# EAGLE design comm (EAGLE 9.6.2)
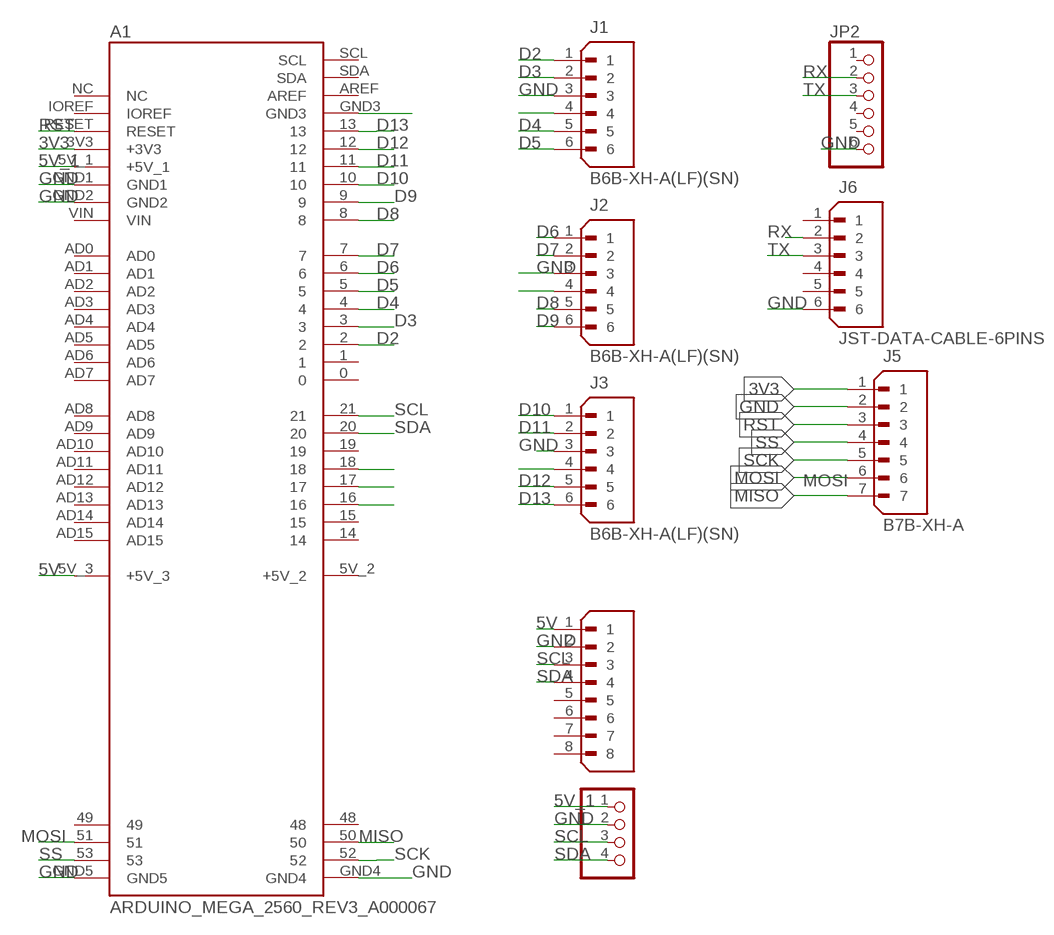
[diagram p0: schematic, sheet 1]

## Parts
A1  ARDUINO_MEGA_2560_REV3_A000067  [ARDUINO_ARDUINO_MEGA_2560_REV3_A000067]
J1  B6B-XH-A(LF)(SN)  [JST_B6B-XH-A(LF)(SN)]
J2  B6B-XH-A(LF)(SN)  [JST_B6B-XH-A(LF)(SN)]
J3  B6B-XH-A(LF)(SN)  [JST_B6B-XH-A(LF)(SN)]
J4  B8B-XH-A(LF)(SN)  [JST_B8B-XH-A(LF)(SN)]
J5  B7B-XH-A  [JST_B7B-XH-A]
J6  JST-DATA-CABLE-6PINS  [JST_B6B-XH-A(LF)(SN)]
JP1  PINHD-1X4  [1X04]
JP2  PINHD-1X6  [1X06]

## Nets
3V3: A1.3V3(+3V3) J5.1
5V: A1.5V_3(+5V_3) J4.1
5V_1: A1.5V_1(+5V_1) JP1.1
D2: A1.2 J1.1
D3: A1.3 J1.2
D4: A1.4 J1.5
D5: A1.5 J1.6
D6: A1.6 J2.1
D7: A1.7 J2.2
D8: A1.8 J2.5
D9: A1.9 J2.6
D10: A1.10 J3.1
D11: A1.11 J3.2
D12: A1.12 J3.4 J3.5
D13: A1.13 J3.6
GND: A1.GND1 A1.GND2 A1.GND4 A1.GND5 J1.3 J2.3 J3.3 J4.2 J5.2 J6.6 JP1.2 JP2.6
MISO: A1.50 J5.7
MOSI: A1.51 J5.6
N$2: A1.18
N$3: A1.17
N$4: J1.4
N$5: J2.4
N$6: A1.16
N$7: A1.GND3
RST: A1.RESET J5.3
RX: J6.2 JP2.2
SCK: A1.52 J5.5
SCL: A1.21 J4.3 JP1.3
SDA: A1.20 J4.4 JP1.4
SS: A1.53 J5.4
TX: J6.3 JP2.3
Unconnected: A1.0 A1.1 A1.5V_2(+5V_2) A1.14 A1.15 A1.19 A1.48 A1.49 A1.AD0 A1.AD1 A1.AD2 A1.AD3 A1.AD4 A1.AD5 A1.AD6 A1.AD7 A1.AD8 A1.AD9 A1.AD10 A1.AD11 A1.AD12 A1.AD13 A1.AD14 A1.AD15 A1.AREF A1.IOREF A1.NC A1.SCL A1.SDA A1.VIN J4.5 J4.6 J4.7 J4.8 J6.1 J6.4 J6.5 JP2.1 JP2.4 JP2.5

## Library data of the parts
A1 = Arduino mega for ROV:ARDUINO_MEGA_2560_REV3_A000067: Check availability <https://pricing.snapeda.com/parts/ARDUINO%20MEGA%202560%20REV3%20%7C%20A000067/Arduino/view-part?ref=eda>; AVAILABILITY: Not in stock; CHECK_PRICES: https://www.snapeda.com/parts/ARDUINO%20MEGA%202560%20REV3%20%7C%20A000067/Arduino/view-part/?ref=eda; DESCRIPTION: ATmega2560 Arduino Mega2560 AVR® ATmega AVR MCU 8-Bit Embedded Evaluation Board; MF: Arduino; MP: ARDUINO MEGA 2560 REV3 | A000067; PACKAGE: Non-Standard Arduino; PRICE: None; PURCHASE-URL: https://www.snapeda.com/api/url_track_click_mouser/?unipart_id=7072122&manufacturer=Arduino&part_name=ARDUINO MEGA 2560 REV3 | A000067&search_term=None; SNAPEDA_LINK: https://www.snapeda.com/parts/ARDUINO%20MEGA%202560%20REV3%20%7C%20A000067/Arduino/view-part/?ref=snap
J1-J3 = data-cable(6-pin):B6B-XH-A(LF)(SN): Check availability <https://pricing.snapeda.com/parts/B6B-XH-A%20%28LF%29%28SN%29/JST%20Sales/view-part?ref=eda>; AVAILABILITY: In Stock; CHECK_PRICES: https://www.snapeda.com/parts/B6B-XH-A%20(LF)(SN)/JST/view-part/?ref=eda; DESCRIPTION: Connector Header Through Hole 6 position 0.098 (2.50mm); MF: JST Sales; MP: B6B-XH-A (LF)(SN); PACKAGE: None; PRICE: None; SNAPEDA_LINK: https://www.snapeda.com/parts/B6B-XH-A%20(LF)(SN)/JST/view-part/?ref=snap
J4 = data-cable(8-pin):B8B-XH-A(LF)(SN): Check availability <https://pricing.snapeda.com/parts/B8B-XH-A%20%28LF%29%28SN%29/JST%20Sales/view-part?ref=eda>; AVAILABILITY: In Stock; CHECK_PRICES: https://www.snapeda.com/parts/B8B-XH-A%20(LF)(SN)/JST/view-part/?ref=eda; DESCRIPTION: Connector Header Through Hole 8 position 0.098 (2.50mm); MF: JST Sales; MP: B8B-XH-A (LF)(SN); PACKAGE: None; PRICE: None; SNAPEDA_LINK: https://www.snapeda.com/parts/B8B-XH-A%20(LF)(SN)/JST/view-part/?ref=snap
J5 = data-cable(7-pin):B7B-XH-A: Check availability <https://pricing.snapeda.com/parts/B7B-XH-A/JST%20Sales/view-part?ref=eda>; AVAILABILITY: In Stock; CHECK_PRICES: https://www.snapeda.com/parts/B7B-XH-A/JST/view-part/?ref=eda; DESCRIPTION: Connector Header Through Hole 7 position 0.098 (2.50mm); MF: JST Sales; MP: B7B-XH-A; PACKAGE: None; PRICE: None; SNAPEDA_LINK: https://www.snapeda.com/parts/B7B-XH-A/JST/view-part/?ref=snap
J6 = M&P-electronics:JST-DATA-CABLE-6PINS: Check availability <https://pricing.snapeda.com/parts/B6B-XH-A%20%28LF%29%28SN%29/JST%20Sales/view-part?ref=eda>; AVAILABILITY: In Stock; CHECK_PRICES: https://www.snapeda.com/parts/B6B-XH-A%20(LF)(SN)/JST/view-part/?ref=eda; DESCRIPTION: Connector Header Through Hole 6 position 0.098 (2.50mm); MF: JST Sales; MP: B6B-XH-A (LF)(SN); PACKAGE: None; PRICE: None; SNAPEDA_LINK: https://www.snapeda.com/parts/B6B-XH-A%20(LF)(SN)/JST/view-part/?ref=snap
JP1 = pinhead:PINHD-1X4: PIN HEADER
JP2 = pinhead:PINHD-1X6: PIN HEADER

## Board
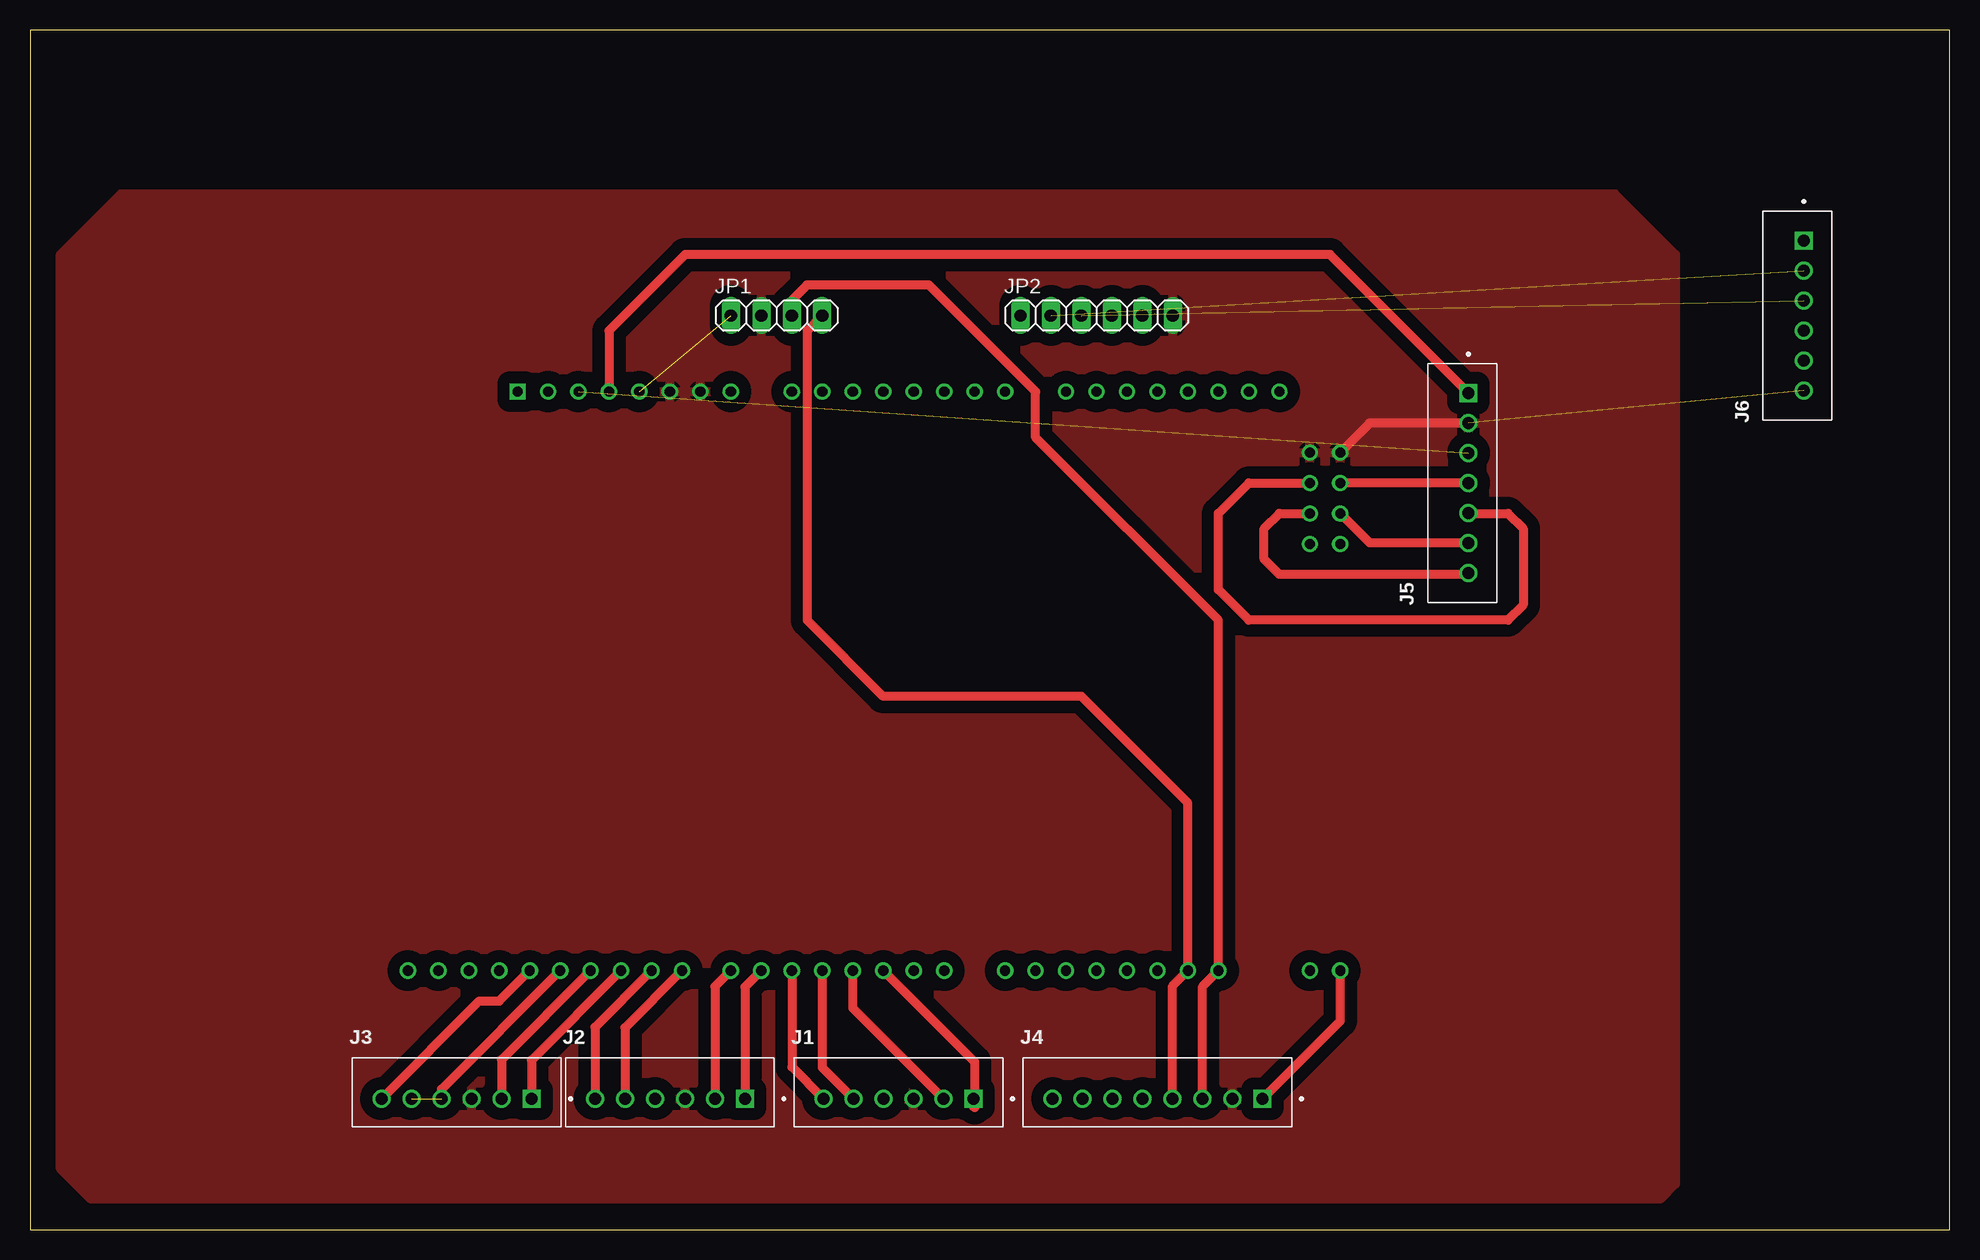
[diagram p1: board, top side]
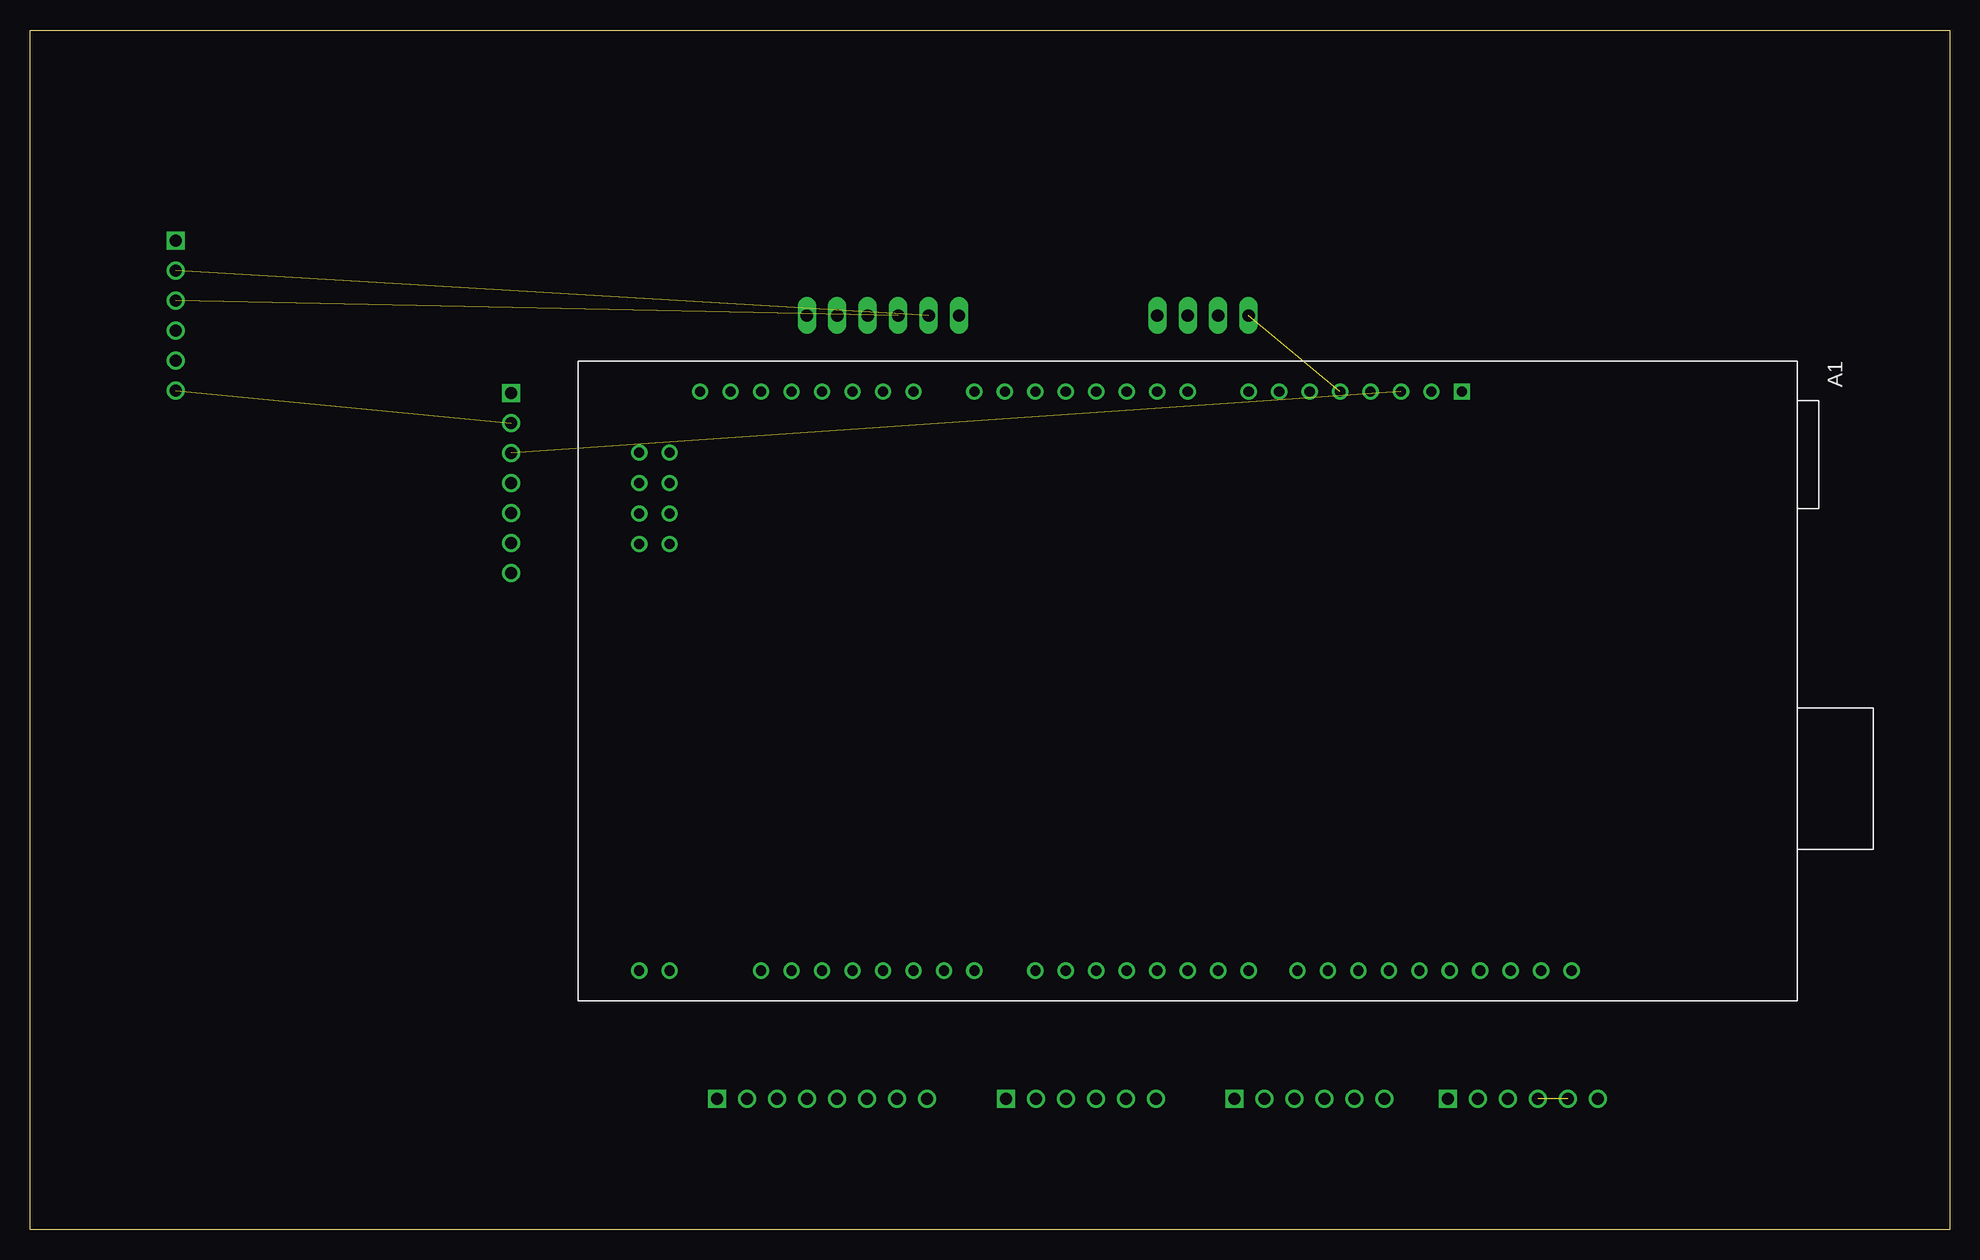
[diagram p2: board, bottom side, seen from below]

Size 160 x 100 mm. Coordinates in mm from the lower left corner, seen from the top.
Outline: 0,0 160,0 160,100 0,100 0,0
Copper layers (1*16): Top 0.035mm / dielectric 1.5mm / Bottom 0.035mm
Design rules "default": minimum track width 6mil, minimum drill 0.35mm, track to track 6mil, track to pad 6mil, pad to pad 6mil, via to via 6mil, smd to smd 6mil, copper to edge 40mil, drill to drill 6mil, minimum pad ring 10mil, minimum via ring 8mil, stop-mask expansion 4mil, vias tented up to drill 0mil, thermal gap 10mil

### Footprints (pad centres in the part's own frame; a part is rotated, then mirrored left to right if it is on the bottom)
ARDUINO_ARDUINO_MEGA_2560_REV3_A000067 = drill 0.85: 0 24.13,-12.7; 1 24.13,-10.16; 2 24.13,-7.62; 3 24.13,-5.08; 3V3 -24.13,15.24; 4 24.13,-2.54; 5 24.13,0; 5V_1 -24.13,12.7; 5V_2 24.13,-43.18; 5V_3 24.13,-45.72; 6 24.13,2.54; 7 24.13,5.08; 8 24.13,9.144; 9 24.13,11.684; 10 24.13,14.224; 11 24.13,16.764; 12 24.13,19.304; 13 24.13,21.844; 14 24.13,-17.78; 15 24.13,-20.32; 16 24.13,-22.86; 17 24.13,-25.4; 18 24.13,-27.94; 19 24.13,-30.48; 20 24.13,-33.02; 21 24.13,-35.56; 48 -11.43,-43.18; 49 -11.43,-45.72; 50 -13.97,-43.18; 51 -13.97,-45.72; 52 -16.51,-43.18; 53 -16.51,-45.72; AD0 -24.13,0; AD1 -24.13,-2.54; AD2 -24.13,-5.08; AD3 -24.13,-7.62; AD4 -24.13,-10.16; AD5 -24.13,-12.7; AD6 -24.13,-15.24; AD7 -24.13,-17.78; AD8 -24.13,-22.86; AD9 -24.13,-25.4; AD10 -24.13,-27.94; AD11 -24.13,-30.48; AD12 -24.13,-33.02; AD13 -24.13,-35.56; AD14 -24.13,-38.1; AD15 -24.13,-40.64; AREF 24.13,26.924; GND1 -24.13,10.16; GND2 -24.13,7.62; GND3 24.13,24.384; GND4 -19.05,-43.18; GND5 -19.05,-45.72; IOREF -24.13,20.32; RESET -24.13,17.78; SCL 24.13,32.004; SDA 24.13,29.464; VIN -24.13,5.08 | drill 0.85 square: NC -24.13,22.86
JST_B6B-XH-A(LF)(SN) = drill 1 square: 1 6.25,-0.525 | drill 1: 2 3.75,-0.525; 3 1.25,-0.525; 4 -1.25,-0.525; 5 -3.75,-0.525; 6 -6.25,-0.525
JST_B8B-XH-A(LF)(SN) = drill 1 square: 1 8.75,-0.525 | drill 1: 2 6.25,-0.525; 3 3.75,-0.525; 4 1.25,-0.525; 5 -1.25,-0.525; 6 -3.75,-0.525; 7 -6.25,-0.525; 8 -8.75,-0.525
JST_B7B-XH-A = drill 1 square: 1 7.5,-0.525 | drill 1: 2 5,-0.525; 3 2.5,-0.525; 4 0,-0.525; 5 -2.5,-0.525; 6 -5,-0.525; 7 -7.5,-0.525
1X04 = drill 1.016 long: 1 -3.81,0; 2 -1.27,0; 3 1.27,0; 4 3.81,0
1X06 = drill 1.016 long: 1 -6.35,0; 2 -3.81,0; 3 -1.27,0; 4 1.27,0; 5 3.81,0; 6 6.35,0

### Placement (x,y rotation side)
A1  63.5,45.72 270 bottom
J1  72.39,11.43 0 top
J2  53.34,11.43 0 top
J3  35.56,11.43 0 top
J4  93.98,11.43 0 top
J5  119.38,62.23 90 top
J6  147.32,76.2 90 top
JP1  62.23,76.2 0 top
JP2  88.9,76.2 0 top

### Tracks (layer width: path | path; a pad name or v marks a point on that pad's centre or on a via)
3V3
  Top 0.762: J5.1 108.36,81.28 54.61,81.28 48.26,74.93 A1.3V3
5V
  Top 0.762: J4.1 109.22,17.39 A1.5V_3
5V_1  (1 unrouted)
D2
  Top 0.762: A1.2 78.74,13.97 78.74,10.16 78.64,10.26 J1.1
D3
  Top 0.762: A1.3 68.58,18.46 J1.2
D4
  Top 0.762: A1.4 66.04,13.51 J1.5
D5
  Top 0.762: A1.5 63.5,13.54 J1.6
D6
  Top 0.762: A1.6 59.59,20.22 J2.1
D7
  Top 0.762: A1.7 57.09,20.26 J2.2
D8
  Top 0.762: A1.8 49.59,16.82 J2.5
D9
  Top 0.762: A1.9 47.09,16.86 J2.6
D10
  Top 0.762: A1.10 41.81,14.12 J3.1
D11
  Top 0.762: A1.11 39.31,14.16 J3.2
D12  (1 unrouted)
  Top 0.762: A1.12 34.31,11.7 J3.4
D13
  Top 0.762: J3.6 37.45,19.05 39.12,19.05 A1.13
GND  (1 unrouted)
  Top 0.762: J5.2 111.68,67.23 A1.GND5
  pour Top (isolate 1.016): 7.62,86.36 132.08,86.36 137.16,81.28 137.16,3.81 135.89,2.54 5.08,2.54 2.54,5.08 2.54,81.28
MISO
  Top 0.762: J5.7 119.78,54.61 104.14,54.61 102.87,55.88 102.87,58.42 104.14,59.69 A1.50
MOSI
  Top 0.762: J5.6 111.68,57.23 A1.51
RST  (1 unrouted)
RX  (1 unrouted)
SCK
  Top 0.762: J5.5 119.94,59.69 123.19,59.69 124.46,58.42 124.46,52.07 123.19,50.8 101.6,50.8 99.06,53.34 99.06,59.69 101.6,62.23 A1.52
SCL
  Top 0.762: J4.3 97.73,20.26 A1.21 99.06,50.8 83.82,66.04 83.82,69.85 74.93,78.74 64.77,78.74 63.5,77.47 JP1.3
SDA
  Top 0.762: J4.4 95.23,20.3 A1.20 96.52,35.56 87.63,44.45 71.12,44.45 64.8,50.77 64.8,74.95 JP1.4
SS
  Top 0.762: J5.4 A1.53
TX  (1 unrouted)